# Altium schematic sheet schematic.SchDoc: <Project Name>
size A4; ENG_APP_DATE: --/--/--; DSN_APP_DATE: --/--/--; CHK_APP_DATE: --/--/--; Engineer: Engineer; Address4: Thành phố Hồ Chí Minh; DocumentNumber: 1; Revision: 1.0; SheetNumber: 1; SheetTotal: 1
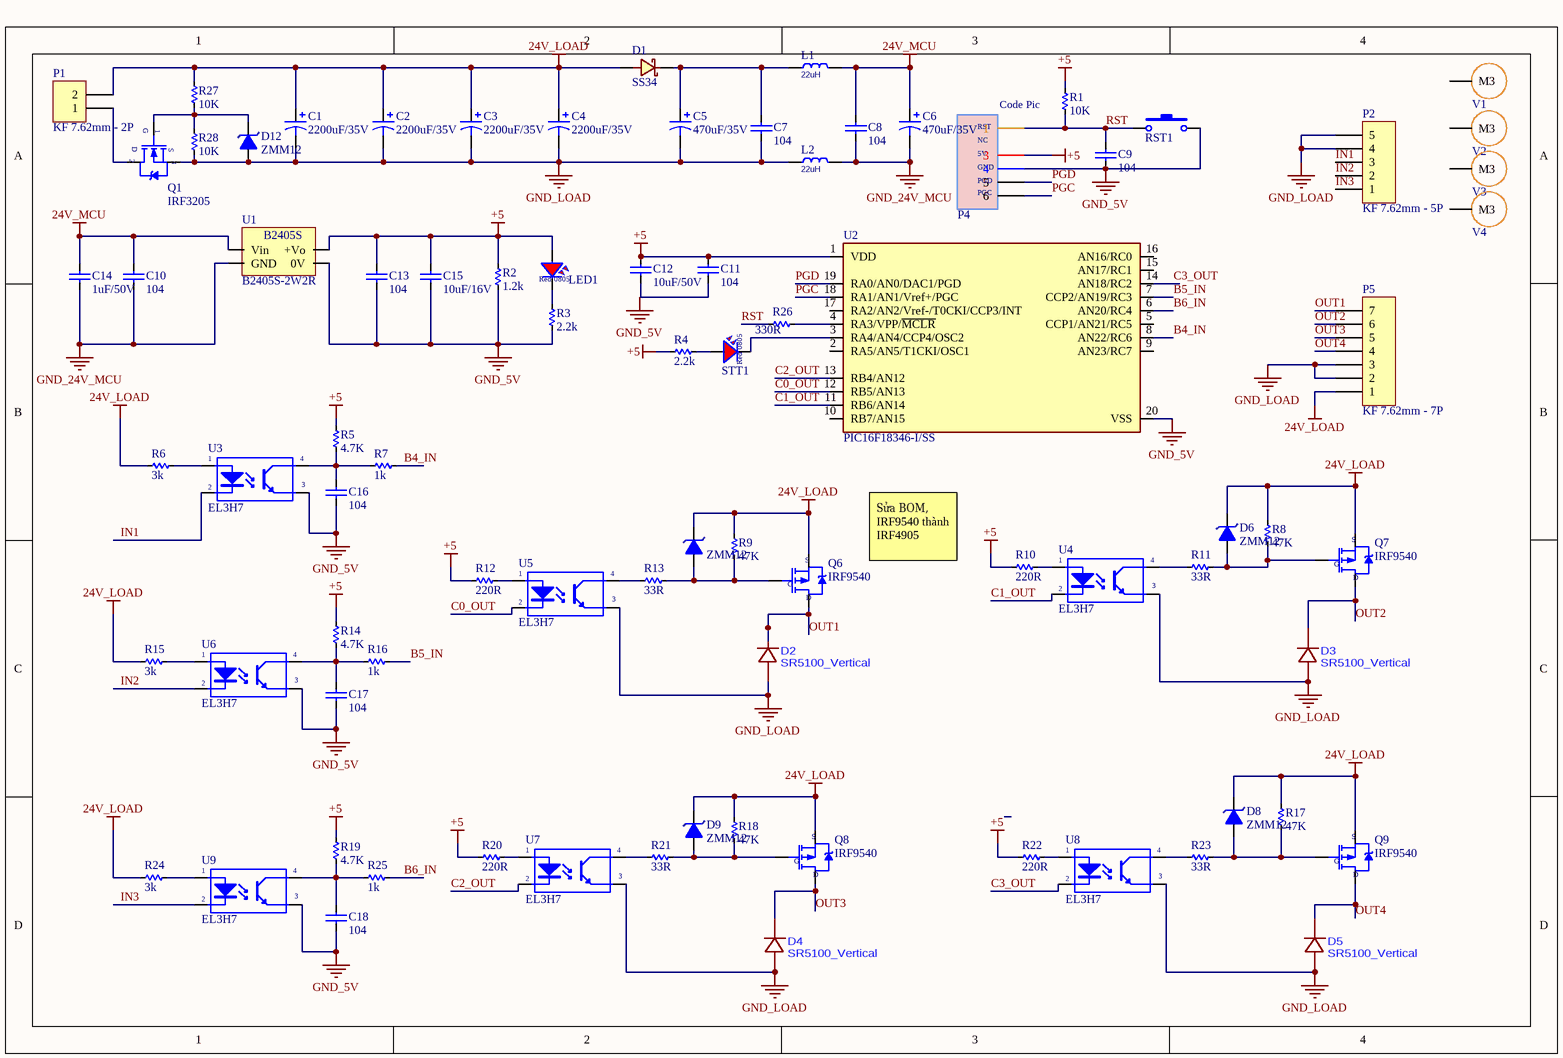
[diagram p0: schematic.SchDoc]

## Parts
?  ZMM12  [SOD80C_MFG]
C1  2200uF/35V  [C_16x27]
C2  2200uF/35V  [C_16x27]
C3  2200uF/35V  [C_16x27]
C4  2200uF/35V  [C_16x27]
C5  470uF/35V  [C8X12mm]
C6  470uF/35V  [C8X12mm]
C7  104  [C_0805_SMD]
C8  104  [C_0805_SMD]
C9  104  [C_0805_SMD]
C10  104  [C_0805_SMD]
C11  104  [C_0805_SMD]
C12  10uF/50V  [C_0805_SMD]
C13  104  [C_0805_SMD]
C14  1uF/50V  [C_0805_SMD]
C15  10uF/16V  [C_0805_SMD]
C16  104  [C_0805_SMD]
C17  104  [C_0805_SMD]
C18  104  [C_0805_SMD]
D1  SS34  [D_SMA]
D2  SR5100_Vertical  [DO-201AD_BD5.3-L8.4-P12.50-D1.4-RD]
D3  SR5100_Vertical  [DO-201AD_BD5.3-L8.4-P12.50-D1.4-RD]
D4  SR5100_Vertical  [DO-201AD_BD5.3-L8.4-P12.50-D1.4-RD]
D5  SR5100_Vertical  [DO-201AD_BD5.3-L8.4-P12.50-D1.4-RD]
D6  ZMM12  [SOD80C_MFG]
D8  ZMM12  [SOD80C_MFG]
D9  ZMM12  [SOD80C_MFG]
D12  ZMM12  [SOD80C_MFG]
L1  22uH  [CDRH104]
L2  22uH  [CDRH104]
LED1  LED RED  [LED 0805 Red]  (value not drawn)
P1  KF 7.62mm - 2P  [KF 7.62 - 2]
P2  KF 7.62mm - 5P  [KF 7.62 - 5]
P4  HDR 6 Male  [Header Code Pic 2.54 6P]  (value not drawn)  (no BOM)
P5  KF 7.62mm - 7P  [KF7.62 7P]
Q1  IRF3205  [QTO-220]
Q6  IRF9540  [QTO-220H3]
Q7  IRF9540  [QTO-220H3]
Q8  IRF9540  [QTO-220H3]
Q9  IRF9540  [QTO-220H3]
R1  10K  [RES-SMD-0805]
R2  1.2k  [RES-SMD-0805]
R3  2.2k  [RES-SMD-0805]
R4  2.2k  [RES-SMD-0805]
R5  4.7K  [RES-SMD-0805]
R6  3k  [RES-SMD-0805]
R7  1k  [RES-SMD-0805]
R8  47K  [RES-SMD-0805]
R9  47K  [RES-SMD-0805]
R10  220R  [RES-SMD-0805]
R11  33R  [RES-SMD-0805]
R12  220R  [RES-SMD-0805]
R13  33R  [RES-SMD-0805]
R14  4.7K  [RES-SMD-0805]
R15  3k  [RES-SMD-0805]
R16  1k  [RES-SMD-0805]
R17  47K  [RES-SMD-0805]
R18  47K  [RES-SMD-0805]
R19  4.7K  [RES-SMD-0805]
R20  220R  [RES-SMD-0805]
R21  33R  [RES-SMD-0805]
R22  220R  [RES-SMD-0805]
R23  33R  [RES-SMD-0805]
R24  3k  [RES-SMD-0805]
R25  1k  [RES-SMD-0805]
R26  330R  [RES-SMD-0805]
R27  10K  [RES-SMD-0805]
R28  10K  [RES-SMD-0805]
RST1  SW-SMD  [SW-SMD 3x6 mm]  (value not drawn)
STT1  LED RED  [LED 0805 Red]  (value not drawn)
U1  B2405S-2W2R  [BS2405S-2W2R]
U2  PIC16F18346-I/SS  [SOG65_20_W]
U3  EL3H7  [SO_4-EL3H7-G_MFG]
U4  EL3H7  [SO_4-EL3H7-G_MFG]
U5  EL3H7  [SO_4-EL3H7-G_MFG]
U6  EL3H7  [SO_4-EL3H7-G_MFG]
U7  EL3H7  [SO_4-EL3H7-G_MFG]
U8  EL3H7  [SO_4-EL3H7-G_MFG]
U9  EL3H7  [SO_4-EL3H7-G_MFG]
V1  Vit m3  [Screw 3.0]  (value not drawn)  (no BOM)
V2  Vit m3  [Screw 3.0]  (value not drawn)  (no BOM)
V3  Vit m3  [Screw 3.0]  (value not drawn)  (no BOM)
V4  Vit m3  [Screw 3.0]  (value not drawn)  (no BOM)

## Nets
24V_LOAD: ?.1(K) C1.1 C2.1 C3.1 C4.1 D1.1(A) D6.1(K) D8.1(K) D9.1(K) P1.2 P5.1 Q6.3(S) Q7.3(S) Q8.3(S) Q9.3(S) R6.2 R8.1 R9.1 R15.2 R17.1 R18.1 R24.2 R27.1
24V_MCU: C6.1 C8.2 C10.2 C14.2 L1.2 U1.1(Vin)
+5: C11.2 C12.2 C13.2 C15.2 LED1.1 P4.3 R1.1 R2.1 R4.2 R5.1 R10.2 R12.2 R14.1 R19.1 R20.2 R22.2 U1.4(+Vo) U2.1(VDD)
GND_5V: C9.1 C13.1 C15.1 C16.1 C17.1 C18.1 P4.4 R2.2 R3.2 RST1.2 U1.3(0V) U2.20(VSS) U3.3(E) U6.3(E) U9.3(E)
GND_24V_MCU: C6.2 C8.1 C10.1 C14.1 L2.2 U1.2(GND)
GND_LOAD: C1.2 C2.2 C3.2 C4.2 C5.2 C7.1 D2.2(A) D3.2(A) D4.2(A) D5.2(A) D12.2(A) L2.1 P2.4 P2.5 P5.2 P5.3 Q1.3(S) R28.2 U4.3(E) U5.3(E) U7.3(E) U8.3(E)
B4_IN: R7.1 U2.8(AN22/RC6)
B5_IN: R16.1 U2.7(CCP2/AN19/RC3)
B6_IN: R25.1 U2.6(AN20/RC4)
C0_OUT: U2.12(RB5/AN13) U5.2(K)
C1_OUT: U2.11(RB6/AN14) U4.2(K)
C2_OUT: U2.13(RB4/AN12) U7.2(K)
C3_OUT: U2.14(AN18/RC2) U8.2(K)
IN1: P2.3 U3.2(K)
IN2: P2.2 U6.2(K)
IN3: P2.1 U9.2(K)
OUT1: D2.1(C) P5.7 Q6.2(D)
OUT2: D3.1(C) P5.6 Q7.2(D)
OUT3: D4.1(C) P5.5 Q8.2(D)
OUT4: D5.1(C) P5.4 Q9.2(D)
PGC: P4.6 U2.18(RA1/AN1/Vref+/PGC)
PGD: P4.5 U2.19(RA0/AN0/DAC1/PGD)
RST: C9.2 P4.1 R1.2 R26.2 RST1.1
Net?_2: ?.2(A) Q6.1(G) R9.2 R13.1
NetC5_1: C5.1 C7.2 D1.2(K) L1.1
NetC11_1: C11.1 C12.1
NetC16_2: C16.2 R5.2 R7.2 U3.4(C)
NetC17_2: C17.2 R14.2 R16.2 U6.4(C)
NetC18_2: C18.2 R19.2 R25.2 U9.4(C)
NetD6_2: D6.2(A) Q7.1(G) R8.2 R11.1
NetD8_2: D8.2(A) Q9.1(G) R17.2 R23.1
NetD9_2: D9.2(A) Q8.1(G) R18.2 R21.1
NetD12_1: D12.1(K) Q1.1(G) R27.2 R28.1
NetLED1_2: LED1.2 R3.1
NetP1_1: P1.1 Q1.2(D)
NetR4_1: R4.1 STT1.1
NetR6_1: R6.1 U3.1(A)
NetR10_1: R10.1 U4.1(A)
NetR11_2: R11.2 U4.4(C)
NetR12_1: R12.1 U5.1(A)
NetR13_2: R13.2 U5.4(C)
NetR15_1: R15.1 U6.1(A)
NetR20_1: R20.1 U7.1(A)
NetR21_2: R21.2 U7.4(C)
NetR22_1: R22.1 U8.1(A)
NetR23_2: R23.2 U8.4(C)
NetR24_1: R24.1 U9.1(A)
NetR26_1: R26.1 U2.4(RA3/VPP/~{MCLR})
NetSTT1_2: STT1.2 U2.3(RA4/AN4/CCP4/OSC2)

Not connected (* = marked no-connect by the designer): U2 2(RA5/AN5/T1CKI/OSC1) 5(CCP1/AN21/RC5) 9(AN23/RC7) 10(RB7/AN15) 15(AN17/RC1) 16(AN16/RC0) 17(RA2/AN2/Vref-/T0CKI/CCP3/INT); V1 1(M3); V2 1(M3); V3 1(M3); V4 1(M3)

## Notes on the sheet
- Sửa BOM, IRF9540 thành IRF4905
- Labels drawn without touching a wire or pin: GND_5V
- Title
- Size:
- Date:
- A4
- Number:
- Time:
- Revision:
- Sheet
- of
- File:
- (in symbol B2405S-2W2R) B2405S
- (in symbol Header Code PIC) Code Pic; RST; NC; 5V; GND; PGD; PGC
- (in symbol LED 0805 RED) Red; 0805

## Library data of the parts
? D6 D8 D9 D12 = ZMM12 Diode Zener: zener 500mW SMD; Code: 2003-023; Designed by: TranLuyen
C1-C4 = Cap Pol 2200uF/35V: Polarized Capacitor (Axial) 2200uF 35V; Code: 1402-234
C5 C6 = Cap Pol 470uF/35V: Polarized Capacitor (Axial) 470uF 35V; Code: 1402-231
C7-C11 C13 C16-C18 = Cap 0805 104 100nF: Cap SMD 0805 104-100nF-0.1uF 50V; Code: 1438-080
C12 = Cap 0805 10uF 50V: Cap SMD 0805 10uF 50V; Code: 1438-100
C14 = Cap 0805 1uF 50V: Cap SMD 0805 105 - 1uF 50V; Code: 1438-092
C15 = Cap 0805 10uF 16V: Cap SMD 0805 10uF 16V; Code: 1435-100
D1 = SS34-SMA: Surface-Mount Schottky Barrier Rectifier; Code: 2005-008
L1 L2 = IND CDRH104 1038-220 22uH 3.6A: Inductor CDRH104 SMD 10x10x3.8mm; Designed by: TranLuyen; Code: N/A
LED1 STT1 = LED 0805 RED: LED 0805 SMD RED; Code: 8600-017; Designed by: TranLuyen
P1 = KF 7.62 - 2Pin: Code: 3519-034; ComponentLink1 Description: Manufacturer; ComponentLink2 Description: Datasheet; Designed by: Tran Luyen; ComponentLink1URL: http://www.we-online.com; ComponentLink2URL: http://katalog.we-online.de/em/datasheet/6911031100xx.pdf
P2 = KF 7.62 - 5P: ComponentLink1 Description: Manufacturer; ComponentLink2 Description: Datasheet; Code: N/A; ComponentLink1URL: http://www.we-online.com; ComponentLink2URL: http://katalog.we-online.de/em/datasheet/6911031100xx.pdf
P4 = Header Code PIC: Header 6-5Pin; Code: NULL
P5 = KF 7.62 - 7P: Code: 3519-038; ComponentLink1 Description: Manufacturer; ComponentLink2 Description: Datasheet; Designed by: Tran Luyen; ComponentLink1URL: http://www.we-online.com; ComponentLink2URL: http://katalog.we-online.de/em/datasheet/6911031100xx.pdf
Q1 = IRF3205 TO-220: MOSFET N - CHANNEL; Value: IRF3205; Code: N/A
Q6-Q9 = IRF9540: P-Channel, Vds = -100V, Vgs = +-20V; Code: 1901-048; Value: IRF9540
R1 R27 R28 = Res 10k 0805: Resistor SMD 0805; Code: 1024-111
R2 = Res 1.2k 0805: Resistor SMD 0805; Code: 1024-088
R3 R4 = Res 2.2K 0805: Resistor SMD 0805; Code: 1024-094
R5 R14 R19 = Res 4.7k 0805: Resistor SMD 0805; Code: 1024-103
R6 R15 R24 = Res 3k 0805: Resistor SMD 0805; Code: 1024-098; Designed by: TranLuyen
R7 R16 R25 = Res 1k 0805: Resistor SMD 0805; Code: 1024-086
R8 R9 R17 R18 = Res 47k 0805: Resistor SMD 0805; Code: 1024-128
R10 R12 R20 R22 = Res 220R 0805: Resistor SMD 0805; Code: 1025-071
R11 R13 R21 R23 = Res 33R 0805: Resistor SMD 0805; Code: N/A
R26 = Res 330R 0805: Resistor SMD 0805; Code: 1024-074
RST1 = SW2 SMD 3x6: Button 3x6 mm x 2.5mm 2Pin SMD; Code: 3606-006
U1 = B2405S-2W2R: B 2405 - DC DC Converter 5V 2WR2; Code: N/A; ComponentLink1Description: Manufacturer Link; ComponentLink2Description: Datasheet; ComponentLink3Description: Packaging Specification
U2 = PIC16F18346-I/SS: IC MCU 8BIT 28KB FLASH 20SSOP; Code: N/A
U3-U9 = EL3H7(C)(TA)-VG SSOP-4: Optocoupler DC-IN 1-CH Transistor DC-OUT 4-Pin SSOP T/R; Code: 2303-012; Designed by: TranLuyen; ComponentLink1Description: Datasheet; ComponentLink1URL: https://datasheet.octopart.com/EL3H7%28C%29%28TA%29-VG-Everlight-datasheet-101745741.pdf
V1-V4 = Screw Vit m3: Code: N/A